# EAGLE design main (EAGLE 8.7.0)
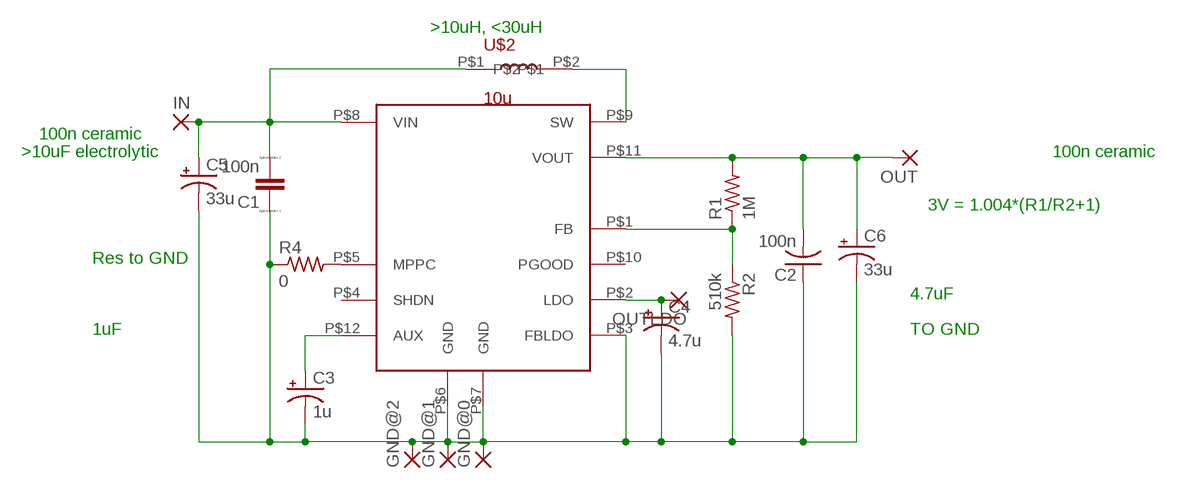
[diagram p0: schematic, sheet 1]

## Parts
C1  100n  CC0603  [C0603]
C2  100n  C-US025-025X050  [C025-025X050]
C3  1u  CPOL-USE1.8-4  [E1,8-4]
C4  4.7u  CPOL-USE1.8-4  [E1,8-4]
C5  33u  CPOL-USE2-5  [E2-5]
C6  33u  CPOL-USE2-5  [E2-5]
GND@0  2,54/1,0  [2,54/1,0]
GND@1  2,54/1,0  [2,54/1,0]
GND@2  2,54/1,0  [2,54/1,0]
IN  2,54/1,0  [2,54/1,0]
OUT  2,54/1,0  [2,54/1,0]
OUTLDO  2,54/1,0  [2,54/1,0]
R1  1M  R-US_0204/2V  [0204V]
R2  510k  R-US_R0603  [R0603]
R4  0  R-US_R0603  [R0603]
U$1  LTC3105  [MSOP_12]
U$2  10u  DR0810  [DR0810]

## Nets
GND: C1.1 C2.1 C3.- C4.- C5.- C6.- GND@0.1(P) GND@1.1(P) GND@2.1(P) R2.2 R4.1 U$1.P$3(FBLDO) U$1.P$6(GND) U$1.P$7(GND)
N$2: C4.+ OUTLDO.1(P) U$1.P$2(LDO)
N$3: R1.1 R2.1 U$1.P$1(FB)
N$4: C3.+ U$1.P$12(AUX)
N$5: C1.2 C5.+ IN.1(P) U$1.P$8(VIN) U$2.P$1
N$6: U$1.P$9(SW) U$2.P$2
N$7: C2.2 C6.+ OUT.1(P) R1.2 U$1.P$11(VOUT)
N$8: R4.2 U$1.P$5(MPPC)
Unconnected: U$1.P$4(SHDN) U$1.P$10(PGOOD)

## Notes on the sheet
- >10uH, <30uH
- 100n ceramic
- >10uF electrolytic | 100n ceramic
- 3V = 1.004*(R1/R2+1)
- Res to GND
- 4.7uF
- 1uF | TO GND

## Library data of the parts
C1 = eagle-ltspice:C: CAPACITOR, European symbol; SPICEMODEL: NONE; SPICEPREFIX: C
C2 = rcl:C-US: CAPACITOR, American symbol; SPICEPREFIX: C
C3-C6 = rcl:CPOL-US: POLARIZED CAPACITOR, American symbol
GND@0 GND@1 GND@2 IN OUT OUTLDO = 7_segment_lib:2,54/1,0: THROUGH-HOLE PAD
R1 R2 R4 = rcl:R-US_: RESISTOR, American symbol
U$1 = 7_segment_lib:LTC3105
U$2 = 7_segment_lib:DR0810

## Board
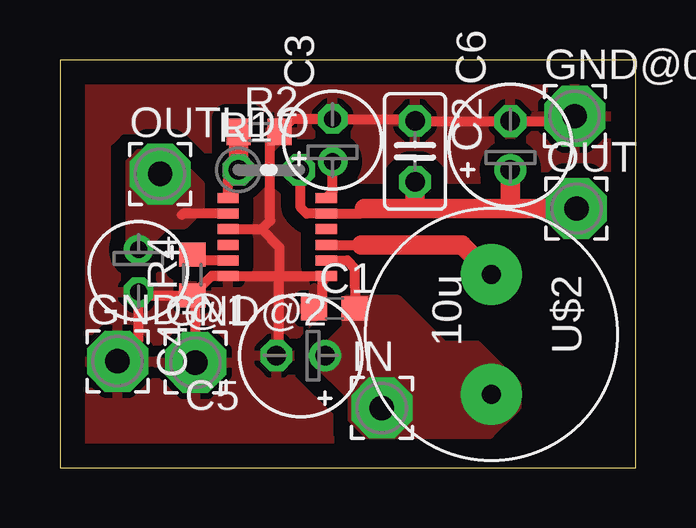
[diagram p1: board, top side]

Size 24 x 17 mm. Coordinates in mm from the lower left corner, seen from the top.
Outline: 0,0 24,0 24,17 0,17 0,0
Copper layers (1*16): Top 0.035mm / dielectric 1.5mm / Bottom 0.035mm
Design rules "default *": minimum track width 12mil, minimum drill 0.5mm, track to track 12mil, track to pad 8mil, pad to pad 8mil, via to via 12mil, smd to smd 8mil, copper to edge 40mil, drill to drill 12mil, minimum pad ring 10mil, minimum via ring 8mil, stop-mask expansion 4mil, vias tented up to drill 0mil, thermal gap 10mil

### Footprints (pad centres in the part's own frame; a part is rotated, then mirrored left to right if it is on the bottom)
C0603 = smd 1.1 x 1: 1 -0.85,0; 2 0.85,0
C025-025X050 = drill 0.813 octagon: 1 -1.27,0; 2 1.27,0
E1,8-4 = drill 0.711 pad 1.168: + -0.889,0 | drill 0.711 pad 1.168 octagon: - 0.889,0
E2-5 = drill 0.813 pad 1.27: + -1.016,0 | drill 0.813 pad 1.27 octagon: - 1.016,0
2,54/1,0 = drill 1.016 pad 2.54 octagon: 1 0,0
0204V = drill 0.813 octagon: 1 -1.27,0; 2 1.27,0
R0603 = smd 1 x 1.1: 1 -0.85,0; 2 0.85,0
MSOP_12 = smd 0.889 x 0.42: P$1 0,0; P$2 0,-0.65; P$3 0,-1.3; P$4 0,-1.95; P$5 0,-2.6; P$6 0,-3.25; P$7 4.089,-3.25; P$8 4.089,-2.6; P$9 4.089,-1.95; P$10 4.089,-1.3; P$11 4.089,-0.65; P$12 4.089,0
DR0810 = drill 0.8 pad 2.54: P$1 2.5,0; P$2 -2.5,0

### Placement (x,y rotation side)
C1  11.44,6.63 0 top
C2  14.8,13.19 270 top
C3  11.37,13.65 90 top
C4  3.27,8.21 270 top
C5  10.04,4.67 180 top
C6  18.78,13.43 90 top
GND@0  21.46,14.66 0 top
GND@1  2.4,4.43 0 top
GND@2  5.65,4.38 0 top
IN  13.42,2.49 0 top
OUT  21.54,10.8 0 top
OUTLDO  4.17,12.24 0 top
R1  8.71,12.41 0 top
R2  8.31,13.99 0 top
R4  5.52,8.04 90 top
U$1  7.01,11.24 0 top
U$2  17.98,5.55 270 top

### Tracks (layer width: path | path; a pad name or v marks a point on that pad's centre or on a via)
GND
  Top 0.406: 9.14,7.99 U$1.P$6 6.32,7.99 R4.1 | 9.14,7.99 U$1.P$7 10.99,7.99 10.92,7.92 10.92,6.96 C1.1 | U$1.P$3 8.4,9.94 | 9.14,7.99 9.14,9.2 8.4,9.94 | C5.- 9.14,4.79 9.14,7.99 | GND@2.1 5.65,7.06 R4.1 | R4.1 3.4,7.19 C4.- 3.27,5.31 GND@1.1 | 8.4,9.94 8.76,10.3 8.76,13.6 R2.2 9.7,14.54 C3.- 14.72,14.54 C2.1 C6.- 21.25,14.45 GND@0.1
  pour Top (isolate 0.61, rank 2): -0.5,17.5 25,17.5 25,-0.5 -0.5,-0.5
N$2
  Top 0.406: U$1.P$2 5.13,10.59 5.08,10.54
  pour Top (no thermals): 3.43,9.14 4.45,10.16 5.21,10.16 5.84,10.79 5.84,11.3 5.84,11.81 4.57,13.08 3.3,13.08 2.92,12.7 2.92,9.27 3.05,9.14
N$3
  Top 0.406: U$1.P$1 7.01,11.98 R1.1
  Top 0.813: R1.1 7.44,13.98 R2.1
N$4
  Top 0.406: U$1.P$12 11.37,11.51 C3.+
N$5
  Top 0.406: U$1.P$8 11.99,8.64 12.28,8.32 12.29,8.3 C1.2
  pour Top (no thermals): 10.54,4.57 12.19,2.92 12.19,2.03 12.83,1.4 13.97,1.4 17.91,1.4 18.92,2.41 19.05,2.54 19.05,3.43 18.29,4.19 17.4,5.08 16,5.08 14.1,6.99 12.57,6.99 11.94,6.99 11.94,6.1 11.94,5.84 11.18,5.08 10.67,4.57
N$6
  Top 0.406: U$1.P$9 12.55,9.29 12.57,9.27
  Top 0.813: 12.57,9.27 16.76,9.27 U$2.P$2
N$7
  Top 0.406: R1.2 10.03,12.36 10.03,10.85 10.29,10.59 U$1.P$11 12.49,10.59 12.71,10.8 | C6.+ 18.8,12.4
  Top 0.813: OUT.1 18.8,10.8 | 18.8,10.8 14.73,10.8 | 14.73,10.8 14.11,10.8 | 14.11,10.8 14.1,10.79 | C6.+ 18.78,10.82 18.8,10.8 | C2.2 14.8,10.88 14.73,10.8 | 14.11,10.8 12.71,10.8 12.7,10.79
N$8
  Top 0.406: U$1.P$5 5.77,8.64 R4.2